# EAGLE design T17_Schematic_The_Useless_Box (EAGLE 7.1.0)
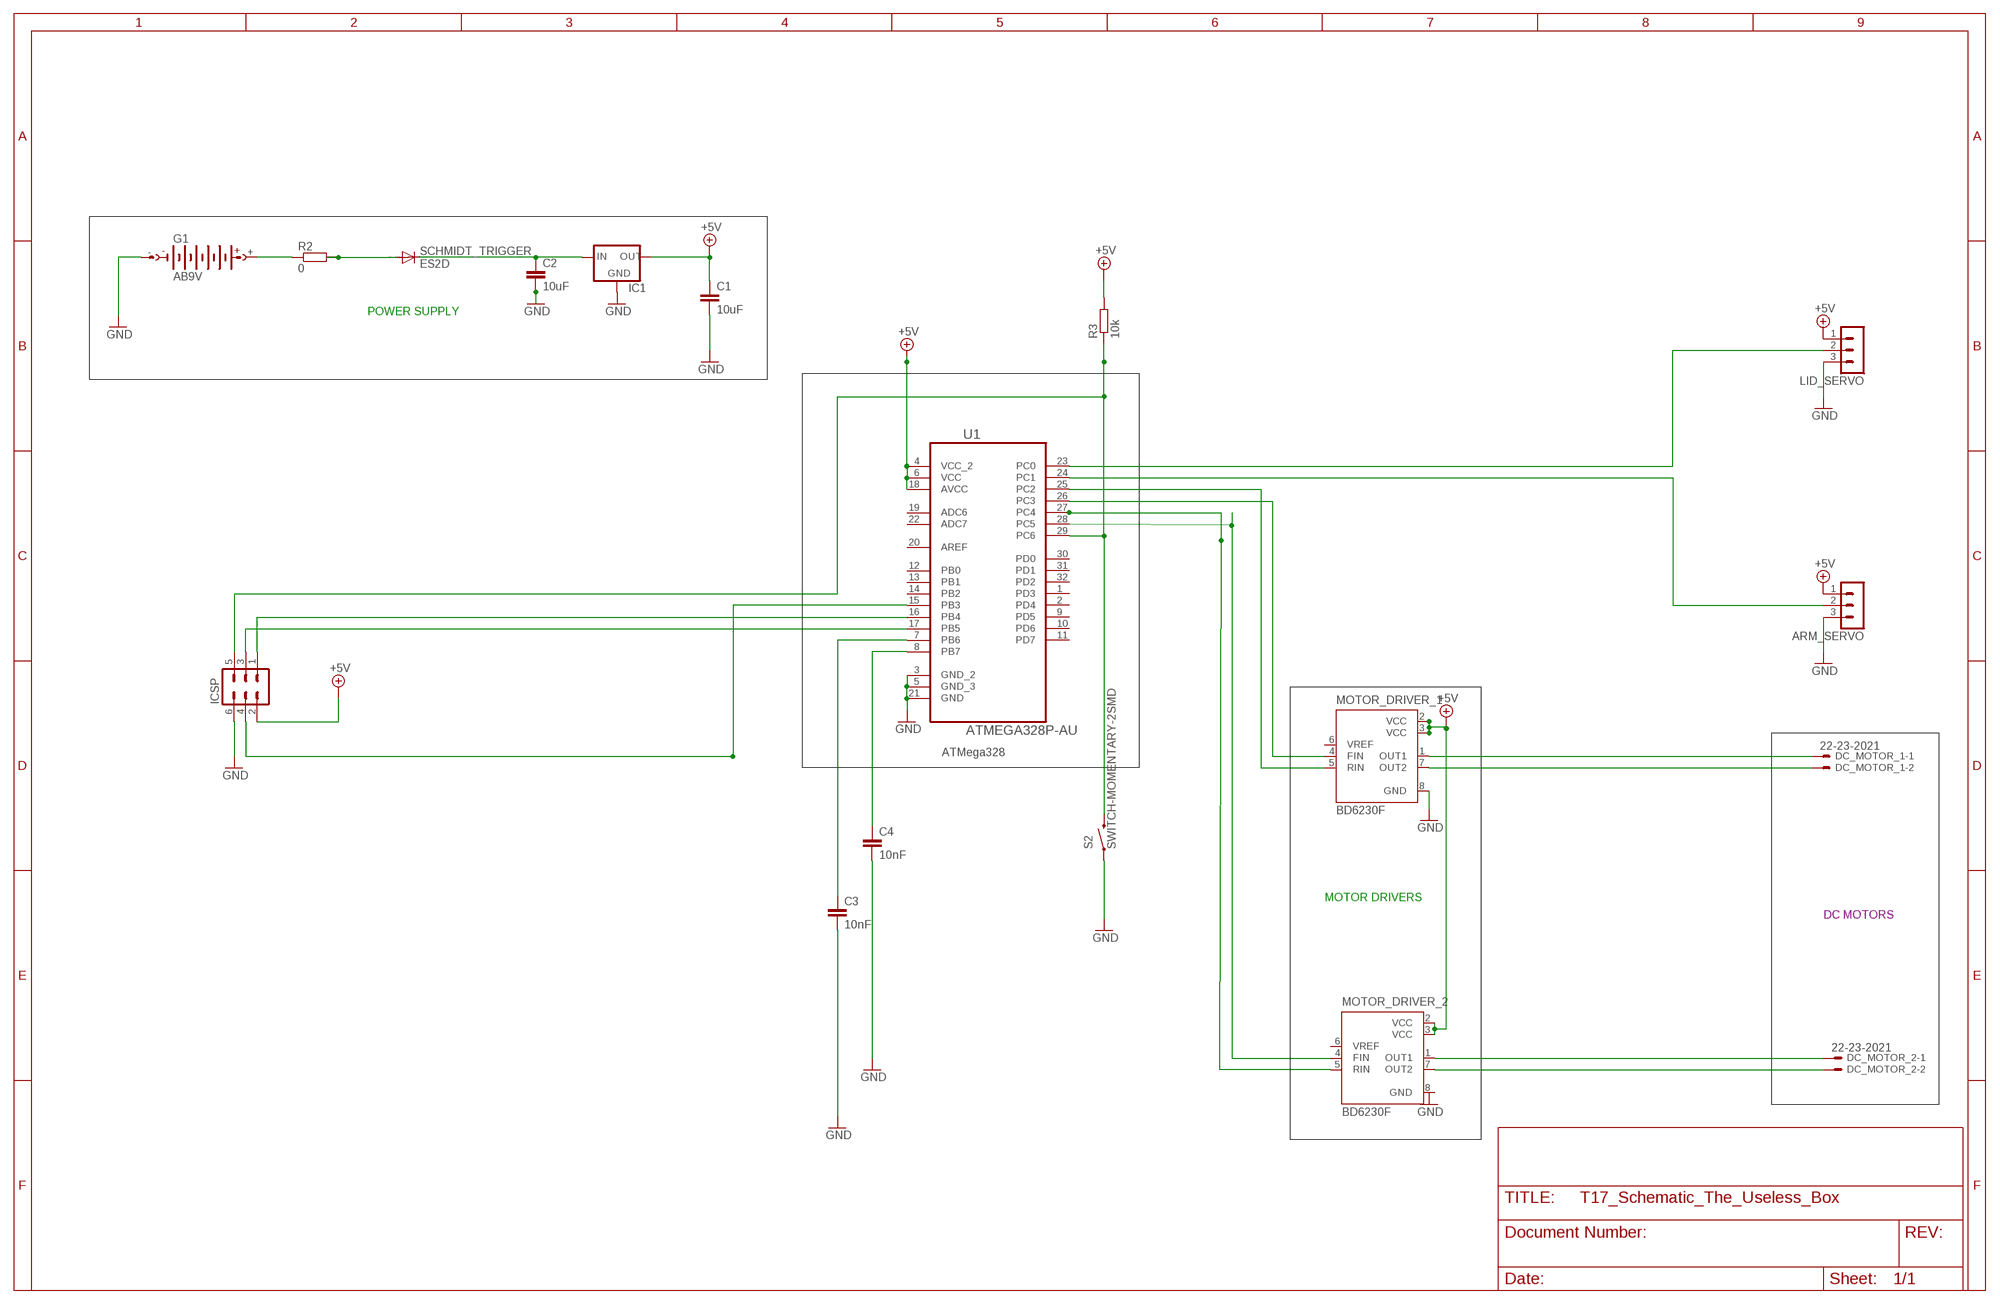
[diagram p0: schematic, sheet 1]

## Parts
ARM_SERVO  MA03-1  [MA03-1]
C1  10uF  C-EUC0805  [C0805]
C2  10uF  C-EUC0805  [C0805]
C3  10nF  C-EUC0805  [C0805]
C4  10nF  C-EUC0805  [C0805]
DC_MOTOR_1  22-23-2021  [22-23-2021]
DC_MOTOR_2  22-23-2021  [22-23-2021]
G1  AB9V  [AB9V]
IC1  78LXX  [78LXX]
ICSP  MA03-2  [MA03-2]
LID_SERVO  MA03-1  [MA03-1]
MOTOR_DRIVER_1  BD6230F  [SOP8]
MOTOR_DRIVER_2  BD6230F  [SOP8]
R2  0  R-EU_R0805  [R0805]
R3  10k  R-EU_R0805  [R0805]
S2  SWITCH-MOMENTARY-2SMD  [TACTILE-SWITCH-SMD]
SCHMIDT_TRIGGER  ES2D  [SMB]
U1  ATMEGA328P-AU  [QFP80P900X900X120-32N]

## Nets
+5V: ARM_SERVO.1 C1.1 IC1.OUT ICSP.2 LID_SERVO.1 MOTOR_DRIVER_1.2(VCC) MOTOR_DRIVER_1.3(VCC) MOTOR_DRIVER_2.2(VCC) MOTOR_DRIVER_2.3(VCC) R3.2 U1.4(VCC_2) U1.6(VCC) U1.18(AVCC)
GND: ARM_SERVO.3 C1.2 C2.2 C3.2 C4.2 G1.- IC1.GND ICSP.6 LID_SERVO.3 MOTOR_DRIVER_1.8(GND) S2.1 U1.3(GND_2) U1.5(GND_3) U1.21(GND)
N$1: ICSP.3 U1.17(PB5)
N$3: C2.1 IC1.IN SCHMIDT_TRIGGER.C
N$6: R2.2 SCHMIDT_TRIGGER.A
N$7: G1.+ R2.1
N$8: ICSP.1 U1.16(PB4)
N$9: ICSP.4 U1.15(PB3)
N$11: C3.1 U1.7(PB6)
N$12: ICSP.5 R3.1 S2.3 U1.29(PC6)
N$14: C4.1 U1.8(PB7)
N$18: MOTOR_DRIVER_1.4(FIN) U1.26(PC3)
N$19: MOTOR_DRIVER_1.5(RIN) U1.25(PC2)
N$20: MOTOR_DRIVER_2.4(FIN) U1.28(PC5)
N$21: MOTOR_DRIVER_2.5(RIN) U1.27(PC4)
N$22: LID_SERVO.2 U1.23(PC0)
N$23: ARM_SERVO.2 U1.24(PC1)
N$24: DC_MOTOR_2.1 MOTOR_DRIVER_2.1(OUT1)
N$25: DC_MOTOR_1.1 MOTOR_DRIVER_1.1(OUT1)
N$26: DC_MOTOR_1.2 MOTOR_DRIVER_1.7(OUT2)
N$27: DC_MOTOR_2.2 MOTOR_DRIVER_2.7(OUT2)
Unconnected: MOTOR_DRIVER_1.6(VREF) MOTOR_DRIVER_2.6(VREF) U1.1(PD3) U1.2(PD4) U1.9(PD5) U1.10(PD6) U1.11(PD7) U1.12(PB0) U1.13(PB1) U1.14(PB2) U1.19(ADC6) U1.20(AREF) U1.22(ADC7) U1.30(PD0) U1.31(PD1) U1.32(PD2)

## Notes on the sheet
- POWER SUPPLY
- ATMega328
- MOTOR DRIVERS
- DC MOTORS

## Power pins joined to a net without a drawn wire
GND: MOTOR_DRIVER_2.8(GND)

## Library data of the parts
ARM_SERVO LID_SERVO = con-lstb:MA03-1: PIN HEADER; OC_FARNELL: unknown; OC_NEWARK: unknown
C1-C4 = rcl:C-EU: CAPACITOR, European symbol
DC_MOTOR_1 DC_MOTOR_2 = con-molex:22-23-2021: .100" (2.54mm) Center Header - 2 Pin; MF: MOLEX; MPN: 22-23-2021; OC_FARNELL: 1462926; OC_NEWARK: 25C3832
G1 = battery:AB9V: 9-V BATTERY CLIP
IC1 = v-reg:78LXX: VOLTAGE REGULATOR
ICSP = con-lstb:MA03-2: PIN HEADER; OC_FARNELL: unknown; OC_NEWARK: unknown
MOTOR_DRIVER_1 MOTOR_DRIVER_2 = rohm:BD623*F: H-bridge driver for brush motors Source: http://www.rohm.com/products/databook/motor/pdf/bd623x_series-e.pdf; MPN: BD6230F-E2; OC_FARNELL: 1716264; OC_NEWARK: 15R0529
R2 R3 = rcl:R-EU_: RESISTOR, European symbol
S2 = SparkFun-Electromechanical:SWITCH-MOMENTARY-2: Various NO switches- pushbuttons, reed, etc; PROD_ID: SWCH-08247
SCHMIDT_TRIGGER = diode:ES2D: DIODE super fast rectifier, 2 A
U1 = Atmel_By_element14_Batch_1-00:ATMEGA328P-AU: 8-bit Microcontroller with In-System Programmable Flash; MPN: ATMEGA328P-AU; OC_FARNELL: 1715486; OC_NEWARK: 14R4631; PACKAGE: TQFP-32; SUPPLIER: Atmel

## Board
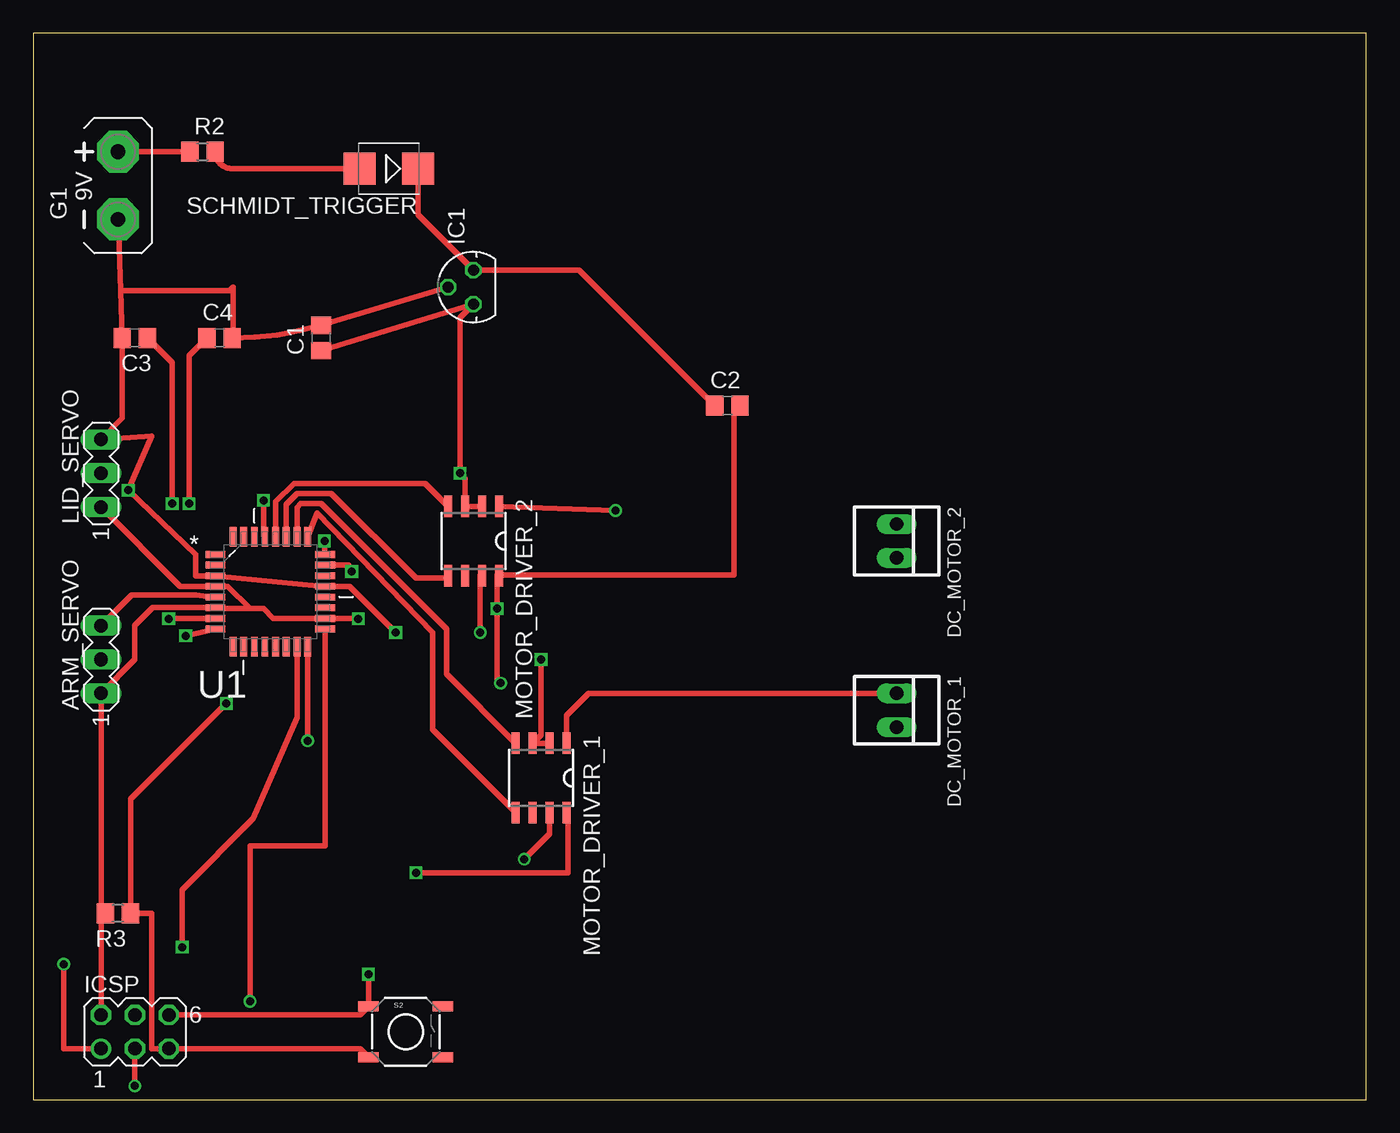
[diagram p1: board, top side]
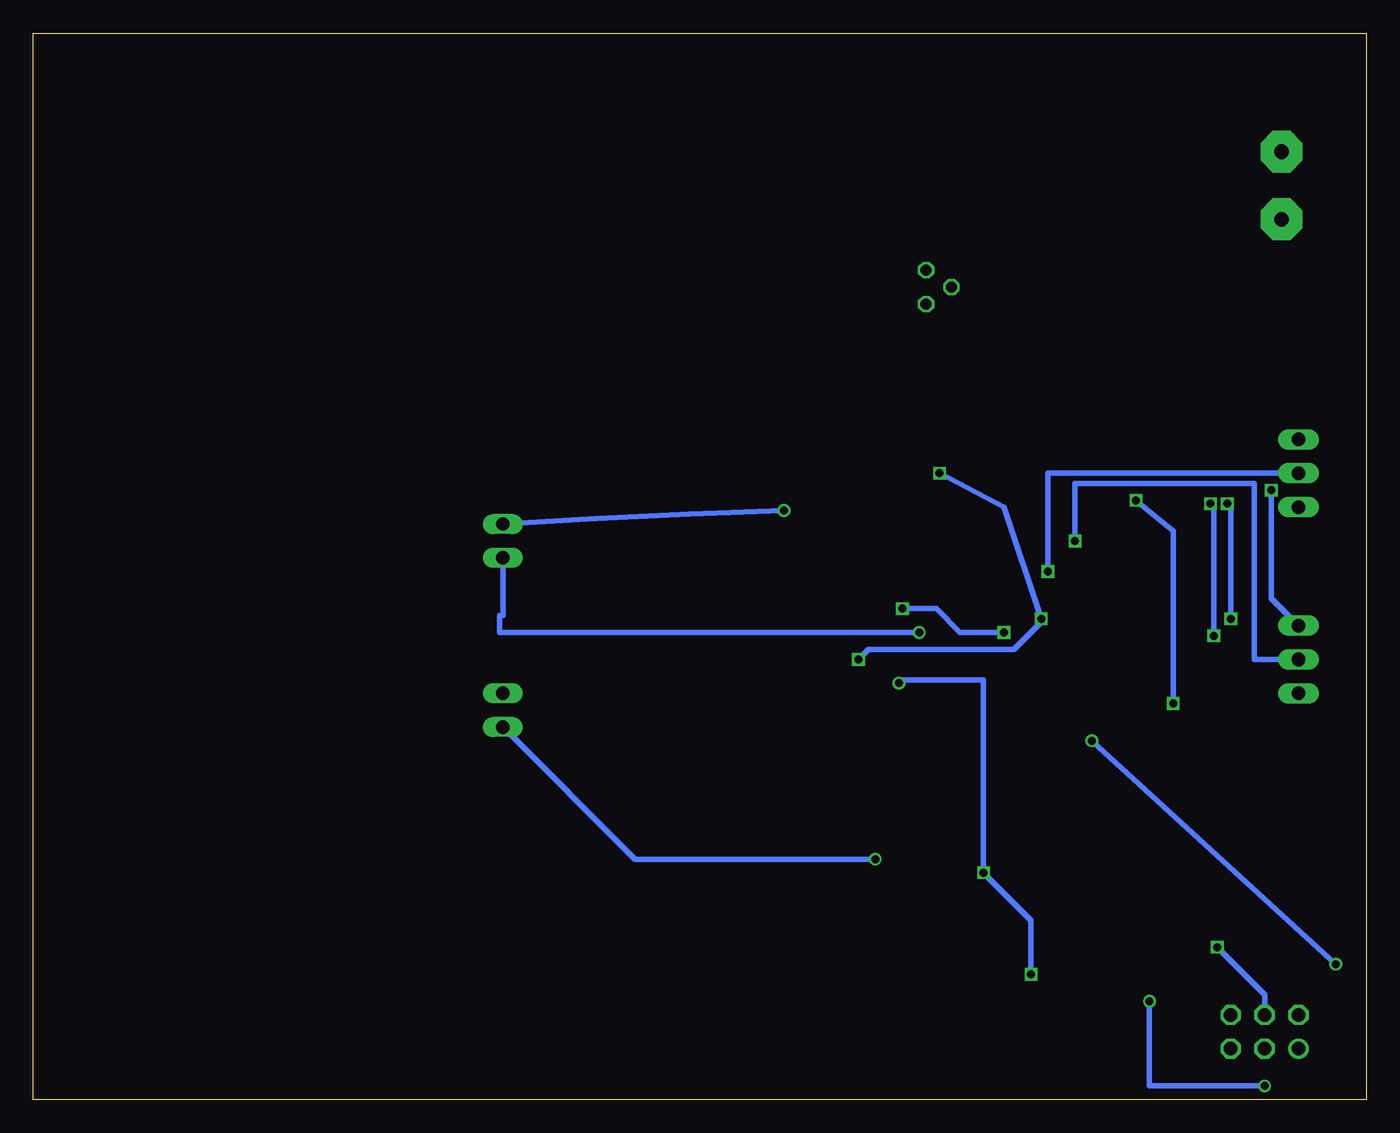
[diagram p2: board, bottom side, seen from below]

Size 100 x 80 mm. Coordinates in mm from the lower left corner, seen from the top.
Outline: 0,0 100,0 100,80 0,80 0,0
Copper layers (1*16): Top 0.0356mm / dielectric 1.5011mm / Bottom 0.0356mm
Design rules "OSH-Park-2-layer": minimum track width 6mil, minimum drill 13mil, track to track 6mil, track to pad 6mil, pad to pad 6mil, via to via 6mil, smd to smd 6mil, copper to edge 15mil, drill to drill 6mil, minimum pad ring 7mil, minimum via ring 7mil, stop-mask expansion 3mil, vias tented up to drill 0mil, thermal gap 10mil

### Footprints (pad centres in the part's own frame; a part is rotated, then mirrored left to right if it is on the bottom)
MA03-1 = drill 1.016 long: 1 -2.54,0; 2 0,0; 3 2.54,0
C0805 = smd 1.3 x 1.5: 1 -0.95,0; 2 0.95,0
22-23-2021 = drill 1 long: 1 -1.27,0; 2 1.27,0
AB9V = drill 1.118 pad 3.15 octagon: + 0,2.54; - 0,-2.54
78LXX = drill 0.813 octagon: GND 0,1.905; IN 1.27,0; OUT -1.27,0
MA03-2 = drill 1.016: 1 -2.54,-1.27 | drill 1.016 octagon: 2 -2.54,1.27; 3 0,-1.27; 4 0,1.27; 5 2.54,-1.27; 6 2.54,1.27
SOP8 = smd 0.6 x 1.6: 1 -1.905,-2.6; 2 -0.635,-2.6; 3 0.635,-2.6; 4 1.905,-2.6; 5 1.905,2.6; 6 0.635,2.6; 7 -0.635,2.6; 8 -1.905,2.6
R0805 = smd 1.3 x 1.5: 1 -0.95,0; 2 0.95,0
TACTILE-SWITCH-SMD = smd 1.524 x 0.762: 1 -2.794,1.905; 2 2.794,1.905; 3 -2.794,-1.905; 4 2.794,-1.905
SMB = smd 2.4 x 2.4: A 2.2,0; C -2.2,0
QFP80P900X900X120-32N = smd 1.473 x 0.508: 1 -4.115,2.794; 2 -4.115,2.007; 3 -4.115,1.194; 4 -4.115,0.406; 5 -4.115,-0.406; 6 -4.115,-1.194; 7 -4.115,-2.007; 8 -4.115,-2.794; 17 4.115,-2.794; 18 4.115,-2.007; 19 4.115,-1.194; 20 4.115,-0.406; 21 4.115,0.406; 22 4.115,1.194; 23 4.115,2.007; 24 4.115,2.794 | smd 0.508 x 1.473: 9 -2.794,-4.115; 10 -2.007,-4.115; 11 -1.194,-4.115; 12 -0.406,-4.115; 13 0.406,-4.115; 14 1.194,-4.115; 15 2.007,-4.115; 16 2.794,-4.115; 25 2.794,4.115; 26 2.007,4.115; 27 1.194,4.115; 28 0.406,4.115; 29 -0.406,4.115; 30 -1.194,4.115; 31 -2.007,4.115; 32 -2.794,4.115

### Placement (x,y rotation side)
ARM_SERVO  5.08,33.02 90 top
C1  21.59,57.15 90 top
C2  52.07,52.07 0 top
C3  7.62,57.15 180 top
C4  13.97,57.15 0 top
DC_MOTOR_1  64.77,29.21 270 top
DC_MOTOR_2  64.77,41.91 270 top
G1  6.35,68.58 0 top
IC1  33.02,60.96 90 top
ICSP  7.62,5.08 0 top
LID_SERVO  5.08,46.99 90 top
MOTOR_DRIVER_1  38.1,24.13 180 top
MOTOR_DRIVER_2  33.02,41.91 180 top
R2  12.7,71.12 0 top
R3  6.35,13.97 180 top
S2  27.94,5.08 0 top
SCHMIDT_TRIGGER  26.67,69.85 180 top
U1  17.78,38.1 0 top

### Tracks (layer width: path | path; a pad name or v marks a point on that pad's centre or on a via)
+5V  (via drill 0.6)
  Top 0.406: C1.1 IC1.OUT 32,58.67 v32,46.99 32.38,46.61 MOTOR_DRIVER_2.3 MOTOR_DRIVER_2.2 | v24.38,36.07 24.41,36.09 U1.18 18.01,36.09 17.27,36.83 16.26,36.83 | LID_SERVO.1 11.02,38.51 U1.4 14.58,38.51 16.26,36.83 | 16.26,36.83 13.74,36.83 U1.6 8.97,36.91 7.62,35.56 7.62,33.02 ARM_SERVO.1 5.08,13.97 R3.2 5.08,13.65 ICSP.2 | MOTOR_DRIVER_1.2 MOTOR_DRIVER_1.3 38.1,27.36 v38.1,33.02
  Bottom 0.406: v32,46.99 27.18,44.45 v24.38,36.07 24.38,35.81 26.42,33.78 37.34,33.78 v38.1,33.02
GND  (via drill 0.6)
  Top 0.406: IC1.GND C1.2 arc-17 C4.2 14.99,57.22 14.99,60.96 14.72,60.7 6.54,60.7 | G1.- 6.54,60.7 | 6.54,60.7 C3.2 6.67,51.12 LID_SERVO.3 8.89,49.78 v7.11,45.72 12.19,40.89 12.19,39.29 U1.3 21.36,38.53 U1.21 23.72,38.51 v27.18,35.05 | C2.2 52.58,52.07 52.58,39.37 34.8,39.37 v34.8,36.83 | v34.8,36.83 34.8,31.5 arc90 v35.05,31.24 | U1.5 13.36,37.69 12.19,37.85 7.37,37.85 ARM_SERVO.3 | v34.8,36.83 34.8,39.18 MOTOR_DRIVER_2.8 | v25.15,9.4 S2.1 24.51,6.35 ICSP.6 | MOTOR_DRIVER_1.8 40.13,21.4 40.13,17.02 v28.7,17.02
  Bottom 0.406: v35.05,31.24 34.8,31.24 34.8,31.5 28.7,31.5 v28.7,17.02 25.15,13.46 v25.15,9.4 | v7.11,45.72 7.11,37.59 ARM_SERVO.3 | v27.18,35.05 30.48,35.05 32.26,36.83 v34.8,36.83
N$1  (via drill 0.6)
  Top 0.406: U1.17 21.89,19.05 16.26,19.05 v16.26,7.37 | v7.62,1.02 ICSP.3
  Bottom 0.406: v16.26,7.37 16.26,1.02 v7.62,1.02
N$3
  Top 0.406: SCHMIDT_TRIGGER.C 28.87,66.38 IC1.IN 40.96,62.23 C2.1
N$6
  Top 0.406: R2.2 arc90 14.92,69.85 SCHMIDT_TRIGGER.A
N$7
  Top 0.406: R2.1 G1.+
N$8  (via drill 0.6)
  Top 0.406: ICSP.1 2.29,3.81 v2.29,10.16 | v20.57,26.92 U1.16
  Bottom 0.406: v2.29,10.16 v20.57,26.92
N$9  (via drill 0.6)
  Top 0.406: U1.15 19.81,28.68 16.51,21.08 11.18,15.75 v11.18,11.43
  Bottom 0.406: v11.18,11.43 7.62,7.87 ICSP.4
N$11  (via drill 0.6)
  Top 0.406: C3.1 10.41,55.31 v10.41,44.7 | v10.16,36.07 10.19,36.09 U1.7
  Bottom 0.406: v10.41,44.7 10.16,44.45 v10.16,36.07
N$12  (via drill 0.6)
  Top 0.406: v14.48,29.72 7.3,22.54 R3.1 8.89,13.97 8.89,3.81 ICSP.5 24.51,3.81 S2.3 | v17.27,44.96 17.27,42.32 U1.29
  Bottom 0.406: v14.48,29.72 14.48,42.67 v17.27,44.96
N$14  (via drill 0.6)
  Top 0.406: C4.1 11.68,55.81 v11.68,44.7 | v11.43,34.8 U1.8
  Bottom 0.406: v11.68,44.7 11.43,44.45 v11.43,34.8
N$18
  Top 0.406: U1.26 19.79,44.42 20.07,44.7 21.59,44.7 30.99,35.31 30.99,31.94 MOTOR_DRIVER_1.4
N$19
  Top 0.406: U1.25 21.29,43.99 29.97,35.05 29.97,27.75 MOTOR_DRIVER_1.5
N$20
  Top 0.406: U1.28 18.19,44.86 19.56,46.23 29.4,46.23 MOTOR_DRIVER_2.4
N$21
  Top 0.406: U1.27 18.97,44.63 19.81,45.47 22.35,45.47 28.7,39.12 30.92,39.12 MOTOR_DRIVER_2.5
N$22  (via drill 0.6)
  Top 0.406: v23.88,39.62 23.65,40.11 U1.23
  Bottom 0.406: LID_SERVO.2 23.88,46.99 v23.88,39.62
N$23  (via drill 0.6)
  Top 0.406: U1.24 21.84,40.95 v21.84,41.91
  Bottom 0.406: ARM_SERVO.2 8.38,33.02 8.38,46.23 21.84,46.23 v21.84,41.91
N$24  (via drill 0.6)
  Top 0.406: MOTOR_DRIVER_2.1 v43.69,44.2
  Bottom 0.406: v43.69,44.2 arc-1 DC_MOTOR_2.1
N$25
  Top 0.406: MOTOR_DRIVER_1.1 40.01,28.83 41.66,30.48 DC_MOTOR_1.1
N$26  (via drill 0.6)
  Top 0.406: MOTOR_DRIVER_1.7 38.73,19.94 v36.83,18.03
  Bottom 0.406: v36.83,18.03 54.86,18.03 DC_MOTOR_1.2
N$27  (via drill 0.6)
  Top 0.406: MOTOR_DRIVER_2.7 33.53,39.31 v33.53,35.05
  Bottom 0.406: v33.53,35.05 65.02,35.05 65.02,36.32 64.77,36.32 DC_MOTOR_2.2